# Altium project AD9833_DDS.PrjPcb
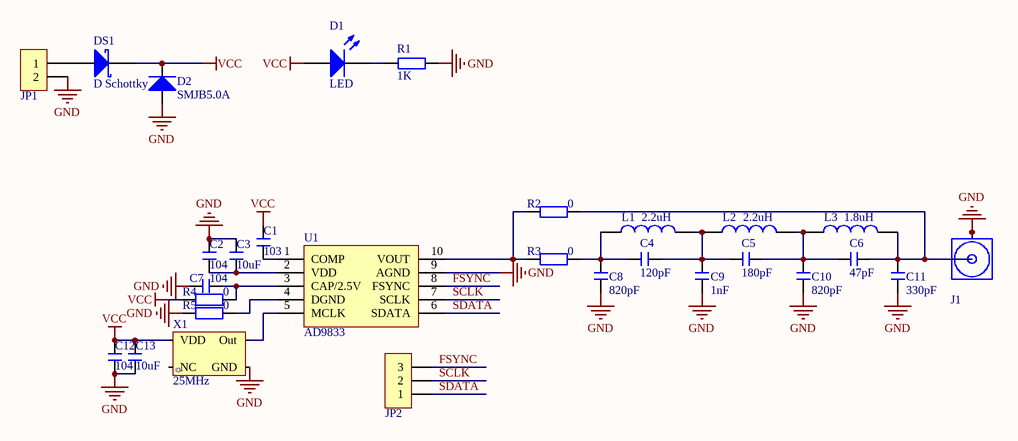
[diagram p0: AD9833.SchDoc]
1 sheet, 29 parts. Net scope: global (net labels, ports and power ports of the same name join across sheets).
Board file: AD9833_DDS.PcbDoc

## Sheet AD9833.SchDoc
size A4

### Parts
C1  103  [C 0603]
C2  104  [C 0603]
C3  10uF  [C 0603]
C4  120pF  [C 0603]
C5  180pF  [C 0603]
C6  47pF  [C 0603]
C7  104  [C 0603]
C8  820pF  [C 0603]
C9  1nF  [C 0603]
C10  820pF  [C 0603]
C11  330pF  [C 0603]
C12  104  [C 0603]
C13  10uF  [C 0603]
D1  LED  [LED_0805]
D2  Type: SMJB5.0A  [DIODE-SMA]  (hidden comment: TVS)
DS1  D Schottky  [DIODE-SMA]
J1  COAX  [MCX5.08-5-H]  (value not drawn)
JP1  HDR-1X2  [XH2.54-2P_H]  (value not drawn)
JP2  HDR-1X3  [HDR-1X3_H]  (value not drawn)
L1  2.2uH  [L 0603]
L2  2.2uH  [L 0603]
L3  1.8uH  [L 0603]
R1  1K  [R 0603]
R2  0  [R 0603]
R3  0  [R 0603]
R4  0  [R 0603]
R5  0  [R 0603]
U1  AD9833  [MSOP-UN10_N]
X1  Frequency: 25MHz  [XTAL-3225]  (hidden comment: XTAL)

### Nets
GND: C2.1 C3.2 C7.2 C8.1 C9.2 C10.1 C11.2 C12.2 C13.1 D2.1(A) J1.2(GND) J1.3(GND) J1.4(GND) J1.5(GND) JP1.2 R1.2 R5.1 U1.9(AGND) X1.2(GND)
VCC: C1.1 C12.1 C13.2 D1.1(A) D2.2(K) DS1.2 R4.1 X1.4(VDD)
FSYNC: JP2.3 U1.8(FSYNC)
SCLK: JP2.2 U1.7(SCLK)
SDATA: JP2.1 U1.6(SDATA)
NetC1_2: C1.2 U1.1(COMP)
NetC2_2: C2.2 C3.1 U1.2(VDD)
NetC4_1: C4.1 C5.1 C9.1 L1.2 L2.1
NetC4_2: C4.2 C8.2 L1.1 R3.2
NetC5_2: C5.2 C6.2 C10.2 L2.2 L3.1
NetC6_1: C6.1 C11.1 J1.1(Signal) L3.2 R2.2
NetC7_1: C7.1 R4.2 U1.3(CAP/2.5V)
NetD1_2: D1.2(K) R1.1
NetDS1_1: DS1.1 JP1.1
NetR2_1: R2.1 R3.1 U1.10(VOUT)
NetR5_2: R5.2 U1.4(DGND)
NetU1_5: U1.5(MCLK) X1.3(Out)

Not connected (* = marked no-connect by the designer): X1 1(NC)

### Library data of the parts
C1-C13 = C: 无极性贴片电容; 版权归属: 源创客; BOM名称: 无极性贴片电容; 学习资源: www.ooocke.com
D1 = LED: 发光二极管; Published: 8-Jun-2000; LatestRevisionDate: 08-Jul-2005; LatestRevisionNote: Mech Layer 1 removed.; PackageReference: LED; Publisher: Altium Limited
D2 = TVS: TVS保护; Published: 8-Jun-2000; LatestRevisionDate: 17-Jul-2002; LatestRevisionNote: Re-released for DXP Platform.; PackageDocument: Sep-1996; PackageReference: SMC; Publisher: Altium Limited; Code_JEDEC: DO-214-AB
DS1 = D Schottky: Schottky Diode; Published: 8-Jun-2000; LatestRevisionDate: 17-Jul-2002; LatestRevisionNote: Re-released for DXP Platform.; PackageReference: SMB; Publisher: Altium Limited; PackageDescription: DO-214-AA/SMB; 2 C-Bend Leads; Body 5.3 x 3.6 mm, inc. leads (LxW); Code_JEDEC: DO-214-AA
JP1 = Header 2: 2P接插件; 版权归属: 源创客; BOM名称: 2P接插件; 学习资源: www.ooocke.com
JP2 = Header 3: 3P接插件; 版权归属: 源创客; BOM名称: 3P接插件; 学习资源: www.ooocke.com
L1-L3 = L: 小功率贴片电感; 版权归属: 源创客; BOM名称: 小功率贴片电感; 学习资源: www.ooocke.com
R1-R5 = R: 贴片电阻; 版权归属: 源创客; BOM名称: 贴片电阻; 学习资源: www.ooocke.com
U1 = AD9833: 低功耗、12.75mW、2.3V至5.5V可编程波形发生器
X1 = XTAL_Oscillator: 有源晶振